# EAGLE design Blinklicht_V1-0 (EAGLE 7.4.0)
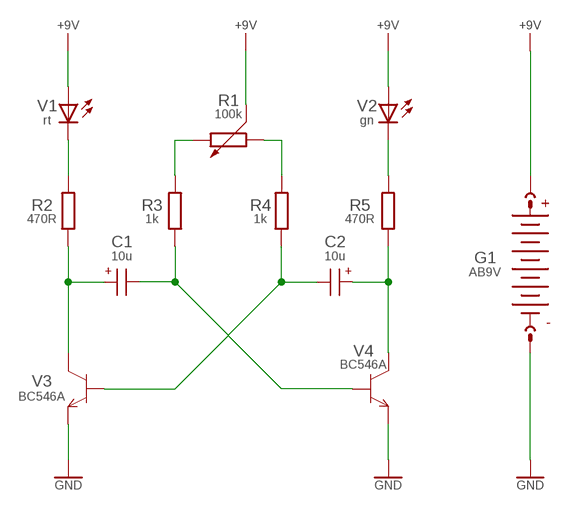
[diagram p0: schematic, sheet 1]

## Parts
C1  10u  CPOL-EUE2-5  [E2-5]
C2  10u  CPOL-EUE2-5  [E2-5]
G1  AB9V  [AB9V]
R1  100k  POTENTIOMETER_PT-10  [PT-10]
R2  470R  R-EU_0207/10  [0207/10]
R3  1k  R-EU_0207/10  [0207/10]
R4  1k  R-EU_0207/10  [0207/10]
R5  470R  R-EU_0207/10  [0207/10]
V1  rt  LED3MM  [LED3MM]
V2  gn  LED3MM  [LED3MM]
V3  BC546A  [TO92-EBC]
V4  BC546A  [TO92-EBC]

## Nets
+9V: G1.+ R1.3 V1.A V2.A
GND: G1.- V3.E V4.E
N$1: R2.2 V1.K(C)
N$2: C1.+ R2.1 V3.C
N$3: R1.2 R3.2
N$4: R1.1 R4.2
N$5: C1.- R3.1 V4.B
N$6: C2.- R4.1 V3.B
N$7: C2.+ R5.1 V4.C
N$8: R5.2 V2.K(C)

## Library data of the parts
C1 C2 = rcl_AttT:CPOL-EU: POLARIZED CAPACITOR, European symbol
G1 = Battery_AttT:AB9V: 9-V BATTERY CLIP
R1 = rcl_AttT:POTENTIOMETER_: Potentiometer
R2-R5 = rcl_AttT:R-EU_: RESISTOR, European symbol
V1 V2 = Led_AttT:LED: LED OSRAM: - CHIPLED LG R971, LG N971, LY N971, LG Q971, LY Q971, LO R971, LY R971 LH N974, LH R974 LS Q976, LO Q976, LY Q976 LO Q996 - Hyper CHIPLED LW Q18S LB Q993, LB Q99A, LB R99A - SideLED LS A670, LO A670, LY A670, LG A670, LP A670 LB A673, LV A673, LT A673, LW A673 LH A674 LY A675 LS A676, LA A676, LO A676, LY A676, LW A676 LS A679, LY A679, LG A679 - Hyper Micro SIDELED® LS Y876, LA Y876, LO Y876, LY Y876 LT Y87S - SmartLED LW L88C, LW L88S LB L89C, LB L89S, LG L890 LS L89K, LO L89K, LY L89K LS L896, LA L896, LO L896, LY L896 - TOPLED LS T670, LO T670, LY T670, LG T670, LP T670 LSG T670, LSP T670, LSY T670, LOP T670, LYG T670 LG T671, LOG T671, LSG T671 LB T673, LV T673, LT T673, LW T673 LH T674 LS T676, LA T676, LO T676, LY T676, LB T676, LH T676, LSB T676, LW T676 LB T67C, LV T67C, LT T67C, LS T67K, LO T67K, LY T67K, LW E67C LS E67B, LA E67B, LO E67B, LY E67B, LB E67C, LV E67C, LT E67C LW T67C LS T679, LY T679, LG T679 LS T770, LO T770, LY T770, LG T770, LP T770 LB T773, LV T773, LT T773, LW T773 LH T774 LS E675, LA E675, LY E675, LS T675 LS T776, LA T776, LO T776, LY T776, LB T776 LHGB T686 LT T68C, LB T68C - Hyper Mini TOPLED® LB M676 - Mini TOPLED Santana® LG M470 LS M47K, LO M47K, LY M47K Source: http://www.osram.convergy.de LUXEON: - LUMILED® LXK2-PW12-R00, LXK2-PW12-S00, LXK2-PW14-U00, LXK2-PW14-V00 LXK2-PM12-R00, LXK2-PM12-S00, LXK2-PM14-U00 LXK2-PE12-Q00, LXK2-PE12-R00, LXK2-PE12-S00, LXK2-PE14-T00, LXK2-PE14-U00 LXK2-PB12-K00, LXK2-PB12-L00, LXK2-PB12-M00, LXK2-PB14-N00, LXK2-PB14-P00, LXK2-PB14-Q00 LXK2-PR12-L00, LXK2-PR12-M00, LXK2-PR14-Q00, LXK2-PR14-R00 LXK2-PD12-Q00, LXK2-PD12-R00, LXK2-PD12-S00 LXK2-PH12-R00, LXK2-PH12-S00 LXK2-PL12-P00, LXK2-PL12-Q00, LXK2-PL12-R00 Source: www.luxeon.com KINGBRIGHT: KA-3528ASYC Source: www.kingbright.com
V3 V4 = Transistor_AttT:BC546*: NPN Transistor

## Board
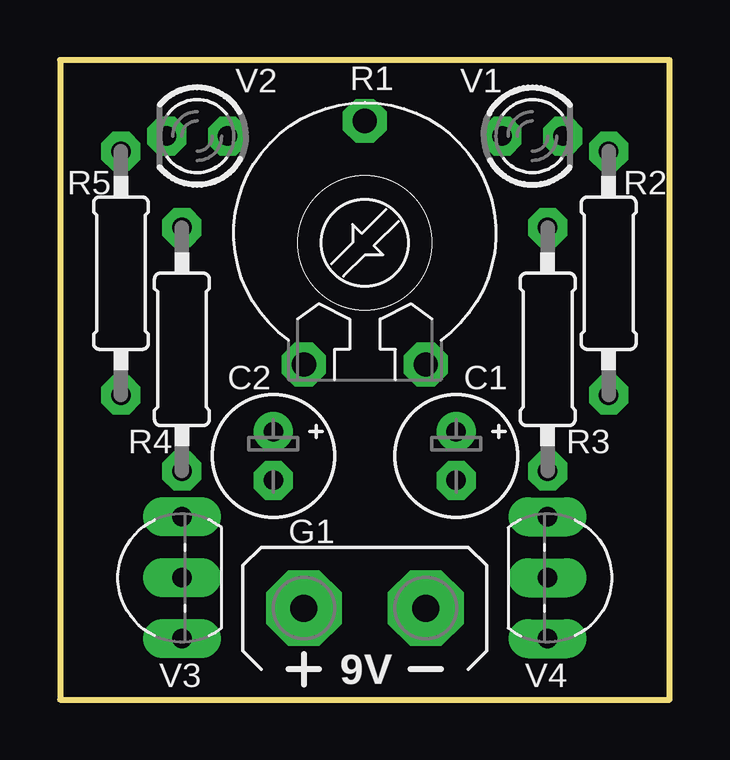
[diagram p1: board, top side]
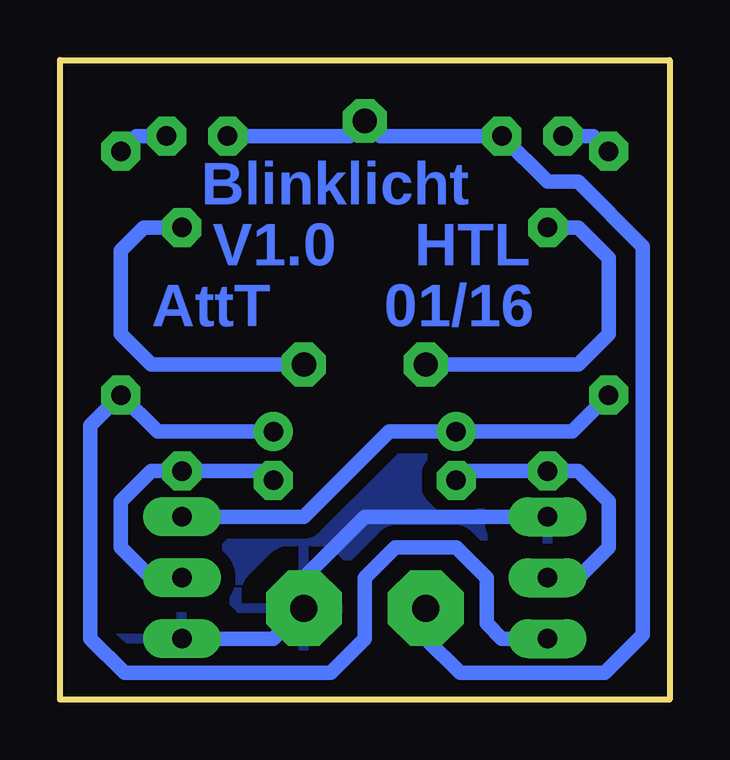
[diagram p2: board, bottom side, seen from below]

Size 25.4 x 26.67 mm. Coordinates in mm from the lower left corner, seen from the top.
Outline: 0,0 25.4,0 25.4,26.67 0,26.66 0,0
Copper layers (1+16): Top 0.035mm / dielectric 1.5mm / Bottom 0.035mm
Design rules "2HN": minimum track width 16mil, minimum drill 0.6mm, track to track 10mil, track to pad 8mil, pad to pad 8mil, via to via 8mil, smd to smd 8mil, copper to edge 20mil, drill to drill 8mil, minimum pad ring 16mil, minimum via ring 15mil, stop-mask expansion 4mil, vias tented up to drill 0mil, thermal gap 40mil

### Footprints (pad centres in the part's own frame; a part is rotated, then mirrored left to right if it is on the bottom)
E2-5 = drill 0.813 pad 1.27: + -1.016,0 | drill 0.813 pad 1.27 octagon: - 1.016,0
AB9V = drill 1.118 pad 3.15 octagon: + 0,2.54; - 0,-2.54
PT-10 = drill 1.016 pad 1.778 octagon: 1 -2.54,-5.08; 2 2.54,-5.08; 3 0,5.08
0207/10 = drill 0.813 octagon: 1 -5.08,0; 2 5.08,0
LED3MM = drill 0.813 octagon: A -1.27,0; K 1.27,0
TO92-EBC = drill 0.813 long: B 0,-1.27; C -2.54,-1.27; E 2.54,-1.27

### Placement (x,y rotation side)
C1  16.51,10.16 270 top
C2  8.89,10.16 270 top
DRILEGEND  [DRILEGEND]  -0.86,-17.03 0 top  (outside the outline)
G1  12.7,3.81 90 top
R1  12.7,19.05 0 top
R2  22.86,17.78 90 top
R3  20.32,14.61 90 top
R4  5.08,14.61 90 top
R5  2.54,17.78 90 top
V1  19.68,23.5 0 top
V2  5.71,23.5 180 top
V3  3.81,5.08 90 top
V4  21.59,5.08 270 top

### Tracks (layer width: path | path; a pad name or v marks a point on that pad's centre or on a via)
+9V
  Bottom 0.61: G1.+ 10.16,2.54 8.73,1.11 2.7,1.11 1.11,2.7 1.11,18.89 3.81,21.59 5.08,21.59 V2.A 12.06,23.5 R1.3 13.34,23.5 V1.A
GND
  Bottom 0.61: V4.E 16.51,2.54 G1.- 15.24,5.08 12.7,7.62 V3.E
  pour Bottom (isolate 0.61): 0,0 0,26.67 25.4,26.67 25.4,0
N$1
  Bottom 0.61: V1.K 22.23,23.5 R2.2
N$2
  Bottom 0.61: V3.C 6.99,2.54 7.62,3.17 7.62,5.08 8.89,6.35 11.43,6.35 12.7,5.08 12.7,2.54 14.13,1.11 22.7,1.11 24.13,2.54 24.13,11.43 R2.1 21.34,11.18 C1.+
N$3
  Bottom 0.61: R3.2 21.91,19.68 22.86,18.73 22.86,15.24 21.59,13.97 R1.2
N$4
  Bottom 0.61: R4.2 3.81,19.68 2.54,18.41 2.54,15.24 3.81,13.97 R1.1
N$5
  Bottom 0.61: C1.- 16.89,9.53 R3.1 21.59,9.53 22.86,8.26 22.86,6.35 21.59,5.08 V4.B
N$6
  Bottom 0.61: C2.- 8.51,9.53 R4.1 3.81,9.53 2.54,8.26 2.54,6.35 3.81,5.08 V3.B
N$7
  Bottom 0.61: V4.C 15.24,7.62 11.68,11.18 C2.+ 4.06,11.18 R5.1
N$8
  Bottom 0.61: R5.2 3.17,23.5 V2.K

### Text on the board
Bottom: Blinklicht | HTL | V1.0 | 01/16 | AttT